# Altium schematic sheet 03.SchDoc (part 1 of 12)